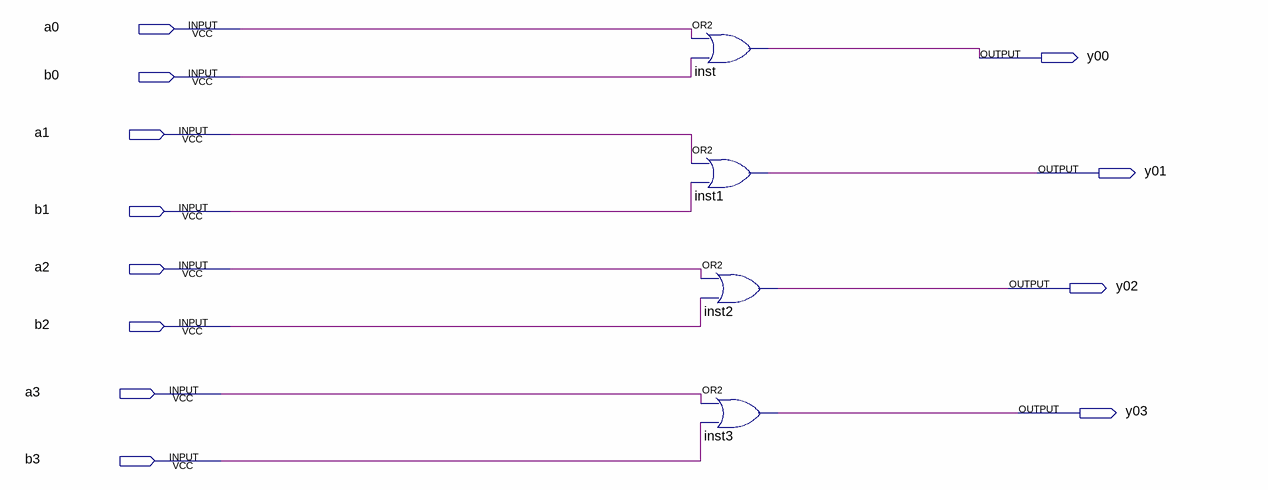
[diagram p0: schematic sheet]
// Quartus schematic OR.bdf as structural Verilog: 4 symbols, 12 pins
module OR (
  input  a0,
  input  b0,
  input  a1,
  input  b1,
  input  a2,
  input  b2,
  input  a3,
  input  b3,
  output y00,
  output y01,
  output y02,
  output y03
);

  or inst (y00, a0, b0);
  or inst1 (y01, a1, b1);
  or inst2 (y02, a2, b2);
  or inst3 (y03, a3, b3);
endmodule
